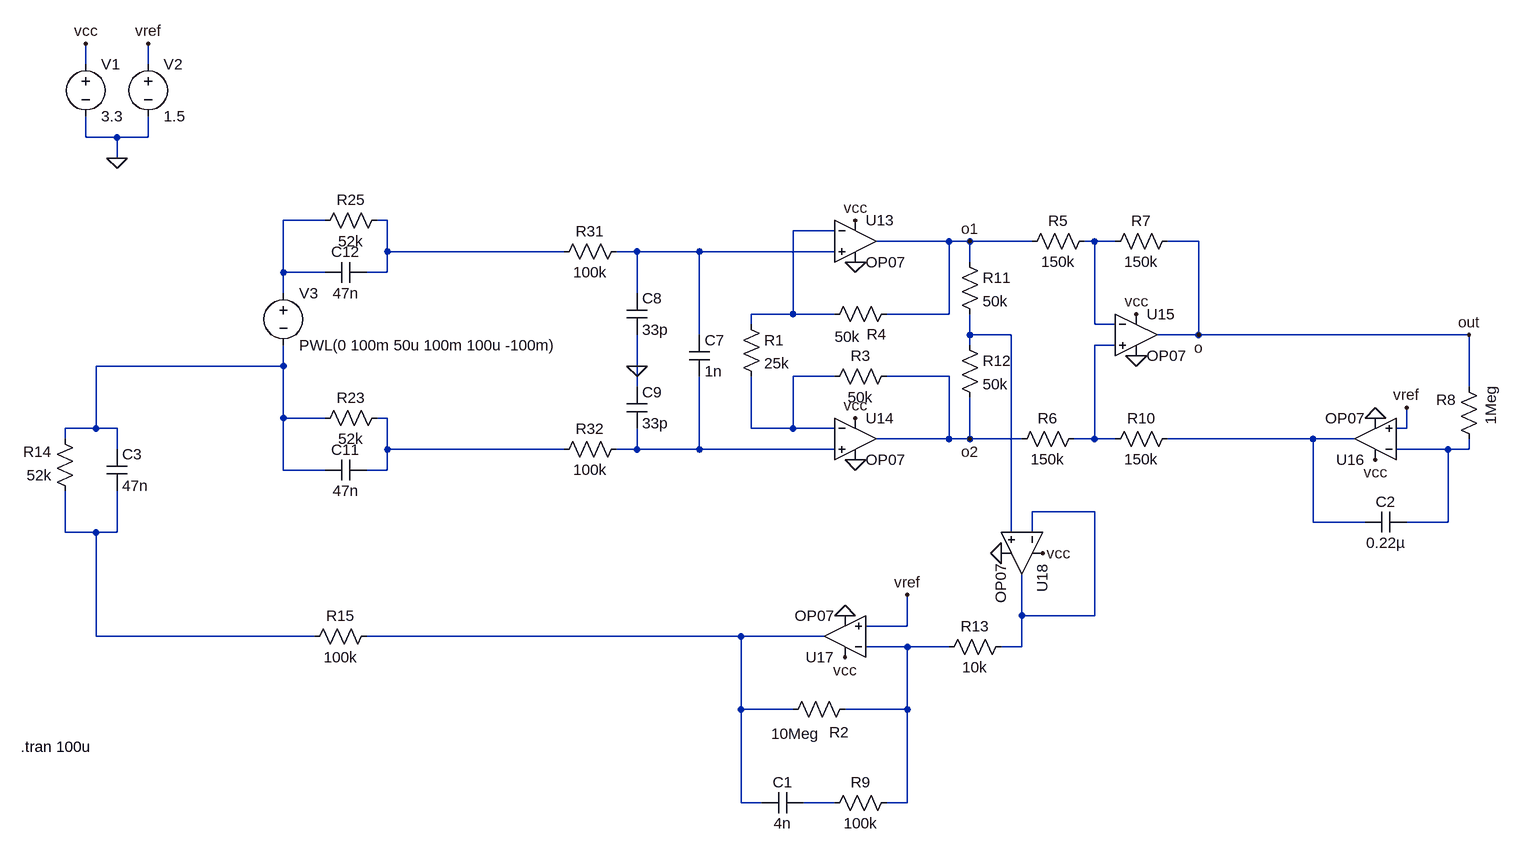
[diagram p0: schematic ECG1.asc]
ECG1.asc, the LTspice schematic file:
Version 4
SHEET 1 3136 1104
WIRE -1920 -208 -1920 -240
WIRE -1824 -208 -1824 -240
WIRE -1920 -96 -1920 -128
WIRE -1872 -96 -1920 -96
WIRE -1824 -96 -1824 -128
WIRE -1824 -96 -1872 -96
WIRE -1872 -64 -1872 -96
WIRE -1552 32 -1616 32
WIRE -1456 32 -1472 32
WIRE -768 48 -832 48
WIRE -592 64 -704 64
WIRE -560 64 -592 64
WIRE -464 64 -560 64
WIRE -368 64 -384 64
WIRE -336 64 -368 64
WIRE -208 64 -256 64
WIRE -1456 80 -1456 32
WIRE -1184 80 -1456 80
WIRE -1072 80 -1104 80
WIRE -976 80 -1072 80
WIRE -768 80 -976 80
WIRE -560 96 -560 64
WIRE -1616 112 -1616 32
WIRE -1552 112 -1616 112
WIRE -1456 112 -1456 80
WIRE -1456 112 -1488 112
WIRE -1616 144 -1616 112
WIRE -1072 144 -1072 80
WIRE -832 176 -832 48
WIRE -832 176 -896 176
WIRE -768 176 -832 176
WIRE -592 176 -592 64
WIRE -592 176 -688 176
WIRE -896 192 -896 176
WIRE -368 192 -368 64
WIRE -336 192 -368 192
WIRE -976 208 -976 80
WIRE -560 208 -560 176
WIRE -496 208 -560 208
WIRE -208 208 -208 64
WIRE -208 208 -272 208
WIRE 208 208 -208 208
WIRE -560 224 -560 208
WIRE -336 224 -368 224
WIRE -1616 256 -1616 224
WIRE -1616 256 -1904 256
WIRE -1072 256 -1072 208
WIRE -768 272 -832 272
WIRE -592 272 -688 272
WIRE -1072 288 -1072 256
WIRE 208 288 208 208
WIRE -1616 336 -1616 256
WIRE -1552 336 -1616 336
WIRE -1456 336 -1472 336
WIRE -1904 352 -1904 256
WIRE -1904 352 -1952 352
WIRE -1872 352 -1904 352
WIRE -896 352 -896 272
WIRE -832 352 -832 272
WIRE -832 352 -896 352
WIRE -768 352 -832 352
WIRE 112 352 112 320
WIRE 112 352 96 352
WIRE -1952 368 -1952 352
WIRE -592 368 -592 272
WIRE -592 368 -704 368
WIRE -560 368 -560 304
WIRE -560 368 -592 368
WIRE -480 368 -560 368
WIRE -368 368 -368 224
WIRE -368 368 -400 368
WIRE -336 368 -368 368
WIRE -32 368 -256 368
WIRE 32 368 -32 368
WIRE -1872 384 -1872 352
WIRE -1456 384 -1456 336
WIRE -1184 384 -1456 384
WIRE -1072 384 -1072 352
WIRE -1072 384 -1104 384
WIRE -976 384 -976 272
WIRE -976 384 -1072 384
WIRE -768 384 -976 384
WIRE 176 384 96 384
WIRE 208 384 208 368
WIRE 208 384 176 384
WIRE -1616 416 -1616 336
WIRE -1552 416 -1616 416
WIRE -1456 416 -1456 384
WIRE -1456 416 -1488 416
WIRE -368 480 -464 480
WIRE -32 496 -32 368
WIRE 48 496 -32 496
WIRE 176 496 176 384
WIRE 176 496 112 496
WIRE -1952 512 -1952 448
WIRE -1904 512 -1952 512
WIRE -1872 512 -1872 448
WIRE -1872 512 -1904 512
WIRE -496 512 -496 208
WIRE -464 512 -464 480
WIRE -480 640 -480 576
WIRE -368 640 -368 480
WIRE -368 640 -480 640
WIRE -656 656 -656 608
WIRE -656 656 -720 656
WIRE -1904 672 -1904 512
WIRE -1568 672 -1904 672
WIRE -912 672 -1488 672
WIRE -784 672 -912 672
WIRE -656 688 -720 688
WIRE -592 688 -656 688
WIRE -480 688 -480 640
WIRE -480 688 -512 688
WIRE -912 784 -912 672
WIRE -832 784 -912 784
WIRE -656 784 -656 688
WIRE -656 784 -752 784
WIRE -912 928 -912 784
WIRE -880 928 -912 928
WIRE -768 928 -816 928
WIRE -656 928 -656 784
WIRE -656 928 -688 928
FLAG -1872 -64 0
FLAG -1920 -240 vcc
FLAG -1824 -240 vref
FLAG -656 608 vref
FLAG -752 640 0
FLAG -736 400 0
FLAG -736 96 0
FLAG -304 240 0
FLAG -736 32 vcc
FLAG -752 704 vcc
FLAG -736 336 vcc
FLAG -304 176 vcc
FLAG -560 64 o1
FLAG -560 368 o2
FLAG -448 544 vcc
FLAG -512 544 0
FLAG 64 400 vcc
FLAG 64 336 0
FLAG 112 320 vref
FLAG -208 208 o
FLAG -1072 256 0
FLAG 208 208 out
SYMBOL res -912 176 R0
SYMATTR InstName R1
SYMATTR Value 25k
SYMBOL res -672 256 R90
WINDOW 0 0 56 VBottom 2
WINDOW 3 32 56 VTop 2
SYMATTR InstName R3
SYMATTR Value 50k
SYMBOL res -672 160 R90
WINDOW 0 63 31 VBottom 2
WINDOW 3 35 76 VTop 2
SYMATTR InstName R4
SYMATTR Value 50k
SYMBOL res -368 48 R90
WINDOW 0 0 56 VBottom 2
WINDOW 3 32 56 VTop 2
SYMATTR InstName R5
SYMATTR Value 150k
SYMBOL res -384 352 R90
WINDOW 0 0 56 VBottom 2
WINDOW 3 32 56 VTop 2
SYMATTR InstName R6
SYMATTR Value 150k
SYMBOL res -240 48 R90
WINDOW 0 0 56 VBottom 2
WINDOW 3 32 56 VTop 2
SYMATTR InstName R7
SYMATTR Value 150k
SYMBOL res -736 768 R90
WINDOW 0 67 25 VBottom 2
WINDOW 3 38 92 VTop 2
SYMATTR InstName R2
SYMATTR Value 10Meg
SYMBOL res -240 352 R90
WINDOW 0 0 56 VBottom 2
WINDOW 3 32 56 VTop 2
SYMATTR InstName R10
SYMATTR Value 150k
SYMBOL voltage -1920 -224 R0
WINDOW 123 0 0 Left 0
WINDOW 39 0 0 Left 0
SYMATTR InstName V1
SYMATTR Value 3.3
SYMBOL voltage -1824 -224 R0
WINDOW 123 0 0 Left 0
WINDOW 39 0 0 Left 0
SYMATTR InstName V2
SYMATTR Value 1.5
SYMBOL res -576 80 R0
SYMATTR InstName R11
SYMATTR Value 50k
SYMBOL res -576 208 R0
SYMATTR InstName R12
SYMATTR Value 50k
SYMBOL res -496 672 R90
WINDOW 0 0 56 VBottom 2
WINDOW 3 32 56 VTop 2
SYMATTR InstName R13
SYMATTR Value 10k
SYMBOL res 224 384 R180
WINDOW 0 36 76 Left 2
WINDOW 3 -18 98 VLeft 2
SYMATTR InstName R8
SYMATTR Value 1Meg
SYMBOL cap 112 480 R90
WINDOW 0 0 32 VBottom 2
WINDOW 3 32 32 VTop 2
SYMATTR InstName C2
SYMATTR Value 0.22µ
SYMBOL OpAmps\\OP07 -736 0 R0
SYMATTR InstName U13
SYMBOL OpAmps\\OP07 -736 304 R0
SYMATTR InstName U14
SYMBOL OpAmps\\OP07 -304 144 R0
SYMATTR InstName U15
SYMBOL OpAmps\\OP07 64 432 R180
SYMATTR InstName U16
SYMBOL OpAmps\\OP07 -752 736 R180
SYMATTR InstName U17
SYMBOL OpAmps\\OP07 -416 544 R90
SYMATTR InstName U18
SYMBOL cap -992 208 R0
SYMATTR InstName C7
SYMATTR Value 1n
SYMBOL cap -1088 144 R0
SYMATTR InstName C8
SYMATTR Value 33p
SYMBOL cap -1088 288 R0
SYMATTR InstName C9
SYMATTR Value 33p
SYMBOL res -1088 64 R90
WINDOW 0 0 56 VBottom 2
WINDOW 3 32 56 VTop 2
SYMATTR InstName R31
SYMATTR Value 100k
SYMBOL res -1088 368 R90
WINDOW 0 0 56 VBottom 2
WINDOW 3 32 56 VTop 2
SYMATTR InstName R32
SYMATTR Value 100k
SYMBOL res -1568 352 R270
WINDOW 0 32 56 VTop 2
WINDOW 3 0 56 VBottom 2
SYMATTR InstName R23
SYMATTR Value 52k
SYMBOL cap -1488 400 R90
WINDOW 0 0 32 VBottom 2
WINDOW 3 32 32 VTop 2
SYMATTR InstName C11
SYMATTR Value 47n
SYMBOL res -1568 48 R270
WINDOW 0 32 56 VTop 2
WINDOW 3 0 56 VBottom 2
SYMATTR InstName R25
SYMATTR Value 52k
SYMBOL cap -1488 96 R90
WINDOW 0 0 32 VBottom 2
WINDOW 3 32 32 VTop 2
SYMATTR InstName C12
SYMATTR Value 47n
SYMBOL res -1936 464 R180
WINDOW 0 36 76 Left 2
WINDOW 3 36 40 Left 2
SYMATTR InstName R14
SYMATTR Value 52k
SYMBOL cap -1888 384 R0
SYMATTR InstName C3
SYMATTR Value 47n
SYMBOL res -1472 656 R90
WINDOW 0 0 56 VBottom 2
WINDOW 3 32 56 VTop 2
SYMATTR InstName R15
SYMATTR Value 100k
SYMBOL voltage -1616 128 R0
WINDOW 123 0 0 Left 0
WINDOW 39 0 0 Left 0
SYMATTR InstName V3
SYMATTR Value PWL(0 100m 50u 100m 100u -100m)
SYMBOL cap -816 912 R90
WINDOW 0 0 32 VBottom 2
WINDOW 3 32 32 VTop 2
SYMATTR InstName C1
SYMATTR Value 4n
SYMBOL res -672 912 R90
WINDOW 0 0 56 VBottom 2
WINDOW 3 32 56 VTop 2
SYMATTR InstName R9
SYMATTR Value 100k
TEXT -2020 842 Left 2 !.tran 100u

The netlist it stands for:
* ECG1.asc
R1 N003 N009 25k
R3 o2 N009 50k
R4 o1 N003 50k
R5 N004 o1 150k
R6 N007 o2 150k
R7 out N004 150k
R2 N017 N016 10Meg
R10 N011 N007 150k
V1 vcc 0 3.3
V2 vref 0 1.5
R11 o1 N006 50k
R12 N006 o2 50k
R13 N014 N017 10k
R8 N013 out 1Meg
C2 N013 N011 0.22µ
XU13 N005 N003 vcc 0 o1 LT1001  ; OP07, pins In+ In- V+ V- OUT
XU14 N012 N009 vcc 0 o2 LT1001  ; OP07, pins In+ In- V+ V- OUT
XU15 N007 N004 vcc 0 out LT1001  ; OP07, pins In+ In- V+ V- OUT
XU16 vref N013 vcc 0 N011 LT1001  ; OP07, pins In+ In- V+ V- OUT
XU17 vref N017 vcc 0 N016 LT1001  ; OP07, pins In+ In- V+ V- OUT
XU18 N006 N014 vcc 0 N014 LT1001  ; OP07, pins In+ In- V+ V- OUT
C7 N005 N012 1n
C8 N005 0 33p
C9 0 N012 33p
R31 N005 N002 100k
R32 N012 N010 100k
R23 N008 N010 52k
C11 N010 N008 47n
R25 N001 N002 52k
C12 N002 N001 47n
R14 N015 N008 52k
C3 N008 N015 47n
R15 N016 N015 100k
V3 N001 N008 PWL(0 100m 50u 100m 100u -100m)
C1 N018 N016 4n
R9 N017 N018 100k
.tran 100u
.lib LTC.lib
.backanno
.end